# EasyEDA schematic schematic.json
TITLE: Sheet_1; REV: 1.0; Date: 2024-09-08; Sheet: 1/1; Drawn By: willycowboy; Company: Your Company
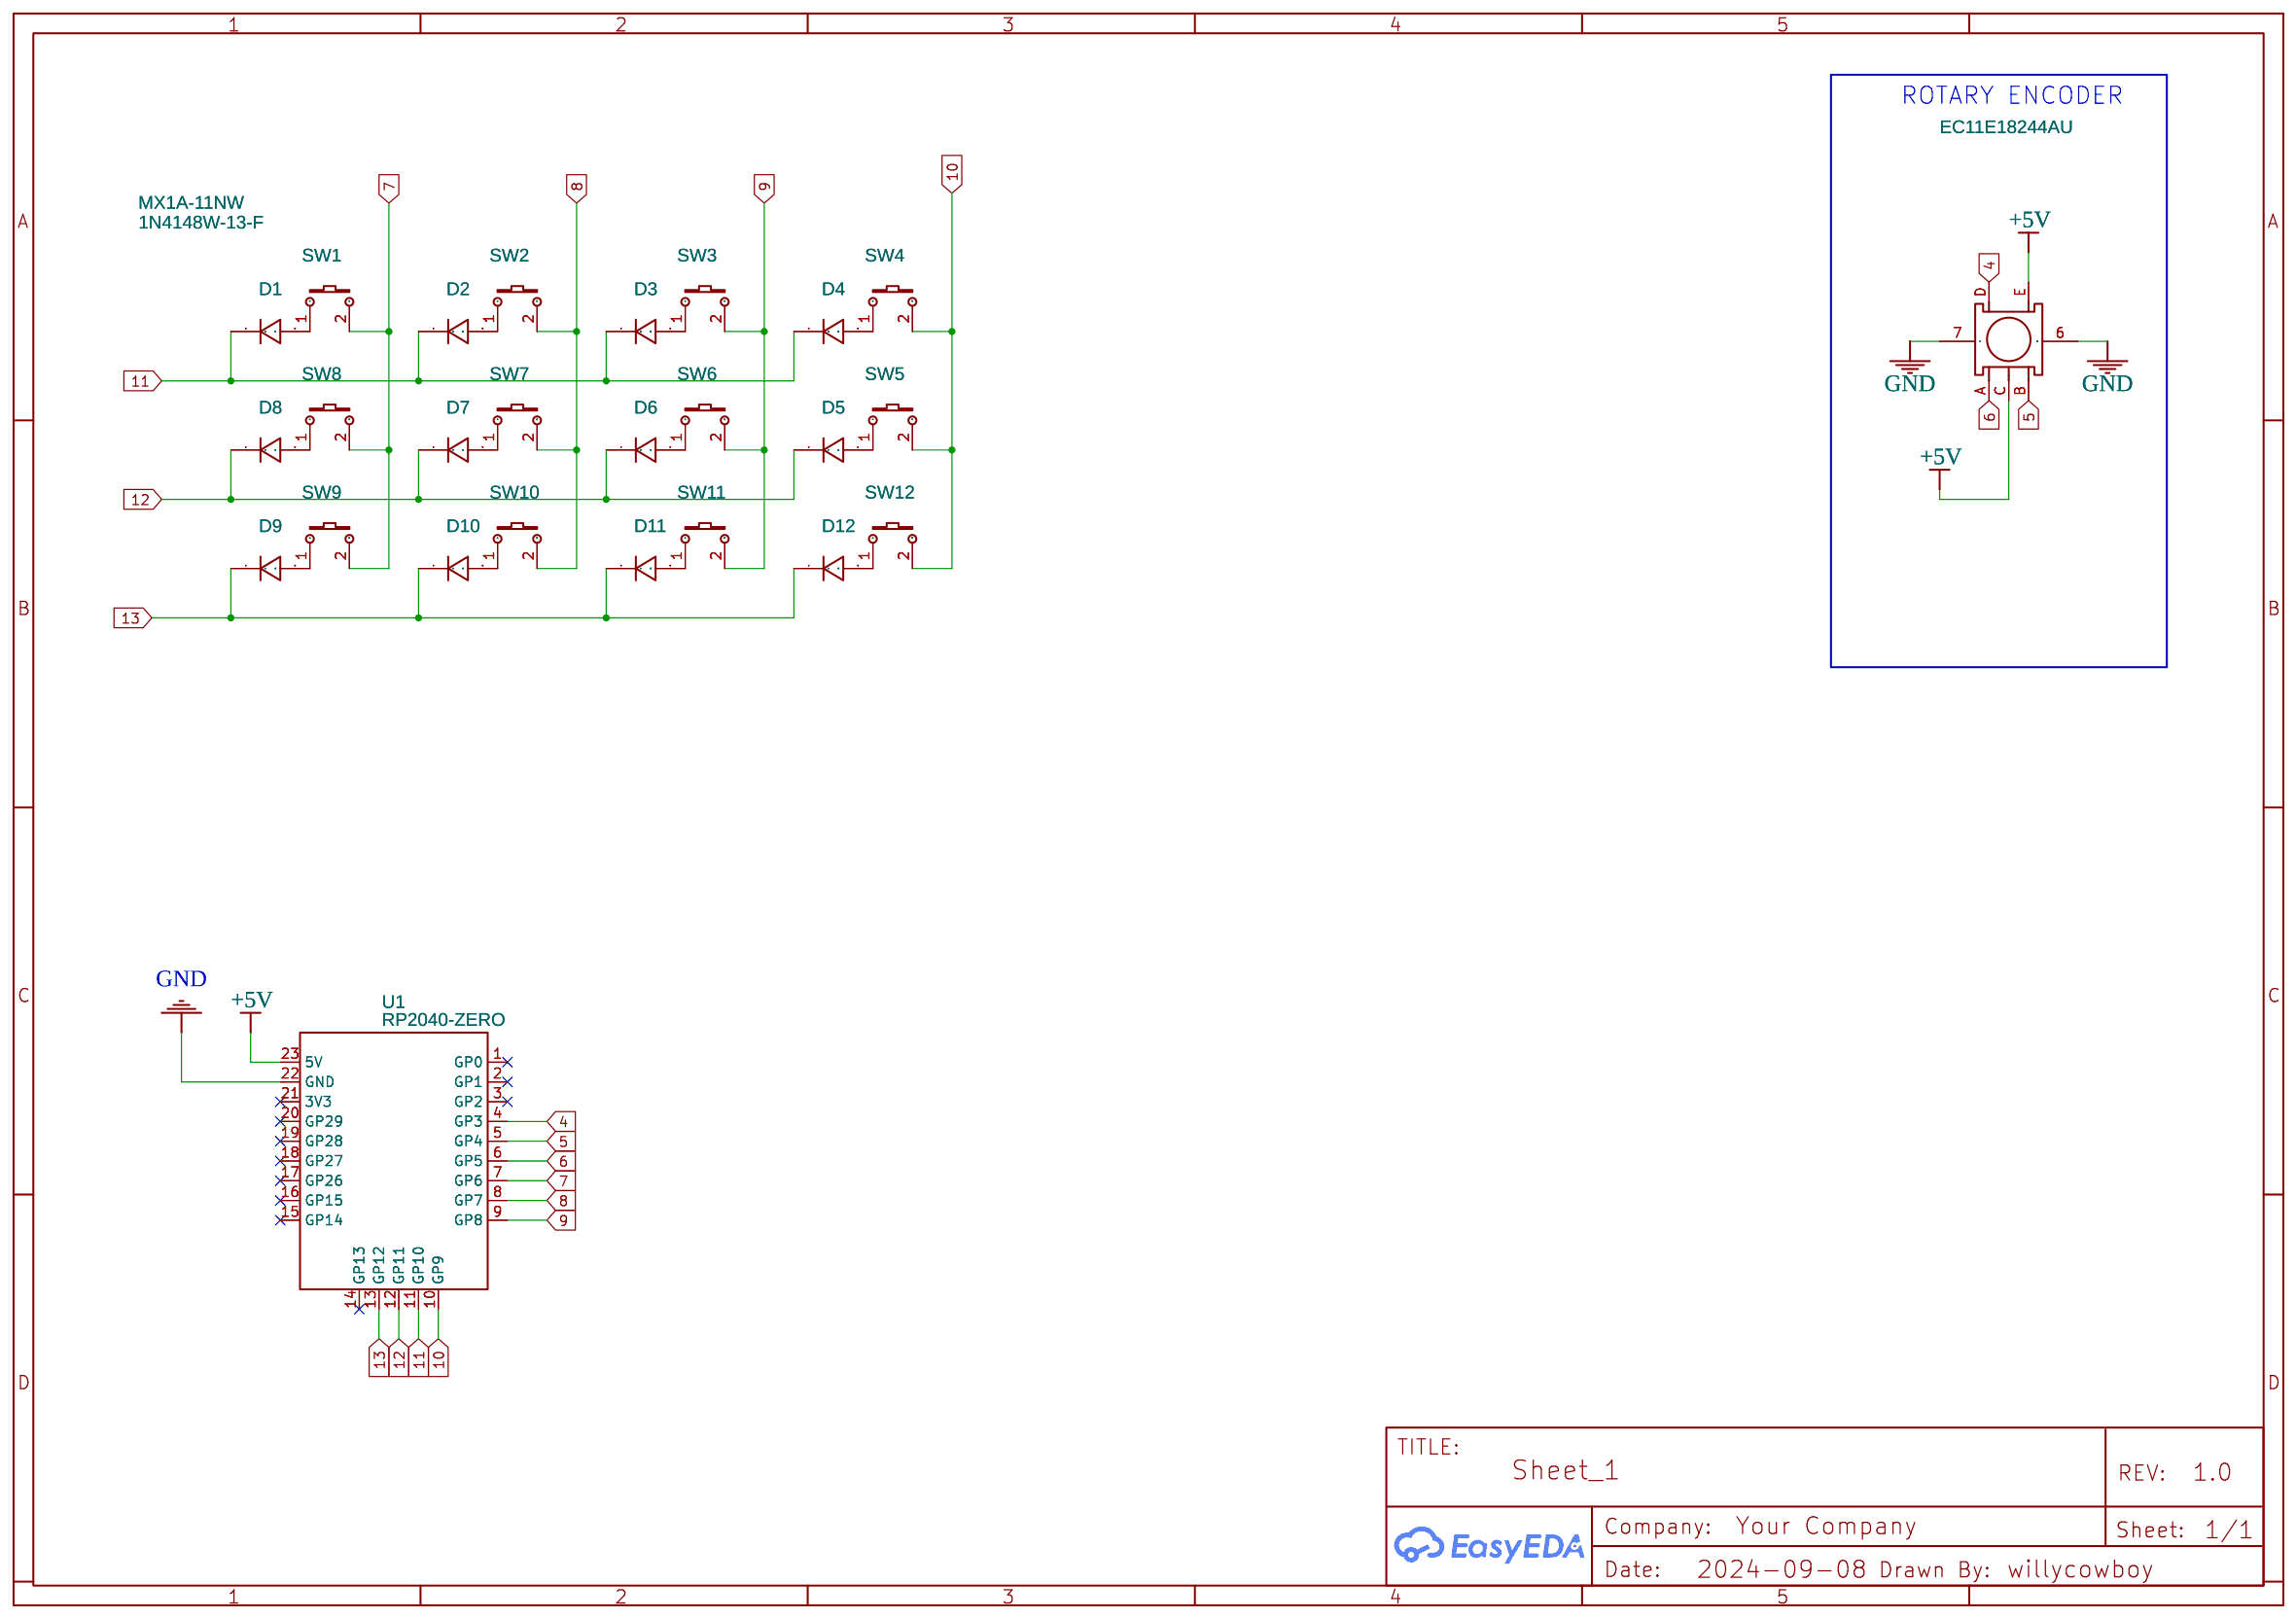
[diagram p0: schematic sheet]

## Parts
D1  1N4148W-13-F  [SOD-123_L2.7-W1.6-LS3.7-RD]
D2  1N4148W-13-F  [SOD-123_L2.7-W1.6-LS3.7-RD]
D3  1N4148W-13-F  [SOD-123_L2.7-W1.6-LS3.7-RD]
D4  1N4148W-13-F  [SOD-123_L2.7-W1.6-LS3.7-RD]
D5  1N4148W-13-F  [SOD-123_L2.7-W1.6-LS3.7-RD]
D6  1N4148W-13-F  [SOD-123_L2.7-W1.6-LS3.7-RD]
D7  1N4148W-13-F  [SOD-123_L2.7-W1.6-LS3.7-RD]
D8  1N4148W-13-F  [SOD-123_L2.7-W1.6-LS3.7-RD]
D9  1N4148W-13-F  [SOD-123_L2.7-W1.6-LS3.7-RD]
D10  1N4148W-13-F  [SOD-123_L2.7-W1.6-LS3.7-RD]
D11  1N4148W-13-F  [SOD-123_L2.7-W1.6-LS3.7-RD]
D12  1N4148W-13-F  [SOD-123_L2.7-W1.6-LS3.7-RD]
SW1  MX1A-11NW  [SW-TH_MX1A-11NW]
SW2  MX1A-11NW  [SW-TH_MX1A-11NW]
SW3  MX1A-11NW  [SW-TH_MX1A-11NW]
SW4  MX1A-11NW  [SW-TH_MX1A-11NW]
SW5  MX1A-11NW  [SW-TH_MX1A-11NW]
SW6  MX1A-11NW  [SW-TH_MX1A-11NW]
SW7  MX1A-11NW  [SW-TH_MX1A-11NW]
SW8  MX1A-11NW  [SW-TH_MX1A-11NW]
SW9  MX1A-11NW  [SW-TH_MX1A-11NW]
SW10  MX1A-11NW  [SW-TH_MX1A-11NW]
SW11  MX1A-11NW  [SW-TH_MX1A-11NW]
SW12  MX1A-11NW  [SW-TH_MX1A-11NW]
SW13  EC11E18244AU  [SW-TH_EC11XXXXXXXX]
U1  RP2040-ZERO  [COMM-SMD_RP2040-ZERO]

## Library data of the parts
D1-D12 = 1N4148W-13-F: Contributor: LCSC; Supplier Part: C112342; Supplier: LCSC; Manufacturer: DIODES(美台); JLCPCB Part Class: Extended Part
SW1-SW12 = MX1A-11NW: Supplier: LCSC; Supplier Part: C3316924; Manufacturer: CHERRY; Contributor: lcsc
SW13 = EC11E18244AU: Contributor: LCSC; Supplier: LCSC; Supplier Part: C202365; Manufacturer: ALPSALPINE(阿尔卑斯阿尔派); JLCPCB Part Class: Extended Part
U1 = RP2040-ZERO: Supplier: LCSC; Supplier Part: C5350143; Manufacturer: Waveshare(微雪电子); Manufacturer Part: RP2040-Zero; JLCPCB Part Class: Extended Part; Contributor: lcsc

## Nets
+5V: SW13.C SW13.E U1.23(5V)
GND: SW13.6 SW13.7 U1.22(GND)
4: SW13.D U1.4(GP3)
5: SW13.B U1.5(GP4)
6: SW13.A U1.6(GP5)
7: SW1.2 SW8.2 SW9.2 U1.7(GP6)
8: SW2.2 SW7.2 SW10.2 U1.8(GP7)
9: SW3.2 SW6.2 SW11.2 U1.9(GP8)
10: SW4.2 SW5.2 SW12.2 U1.10(GP9)
11: D1.1 D2.1 D3.1 D4.1 U1.11(GP10)
12: D5.1 D6.1 D7.1 D8.1 U1.12(GP11)
13: D9.1 D10.1 D11.1 D12.1 U1.13(GP12)
Net-(D1-2): D1.2 SW1.1
Net-(D2-2): D2.2 SW2.1
Net-(D3-2): D3.2 SW3.1
Net-(D4-2): D4.2 SW4.1
Net-(D5-2): D5.2 SW5.1
Net-(D6-2): D6.2 SW6.1
Net-(D7-2): D7.2 SW7.1
Net-(D8-2): D8.2 SW8.1
Net-(D9-2): D9.2 SW9.1
Net-(D10-2): D10.2 SW10.1
Net-(D11-2): D11.2 SW11.1
Net-(D12-2): D12.2 SW12.1

Not connected (* = marked no-connect by the designer): U1 1(GP0)* 2(GP1)* 3(GP2)* 14(GP13)* 15(GP14)* 16(GP15)* 17(GP26)* 18(GP27)* 19(GP28)* 20(GP29)* 21(3V3)*

## Notes on the sheet
- ROTARY ENCODER
